# Altium schematic sheet oxi_dev3.SchDoc
size A2
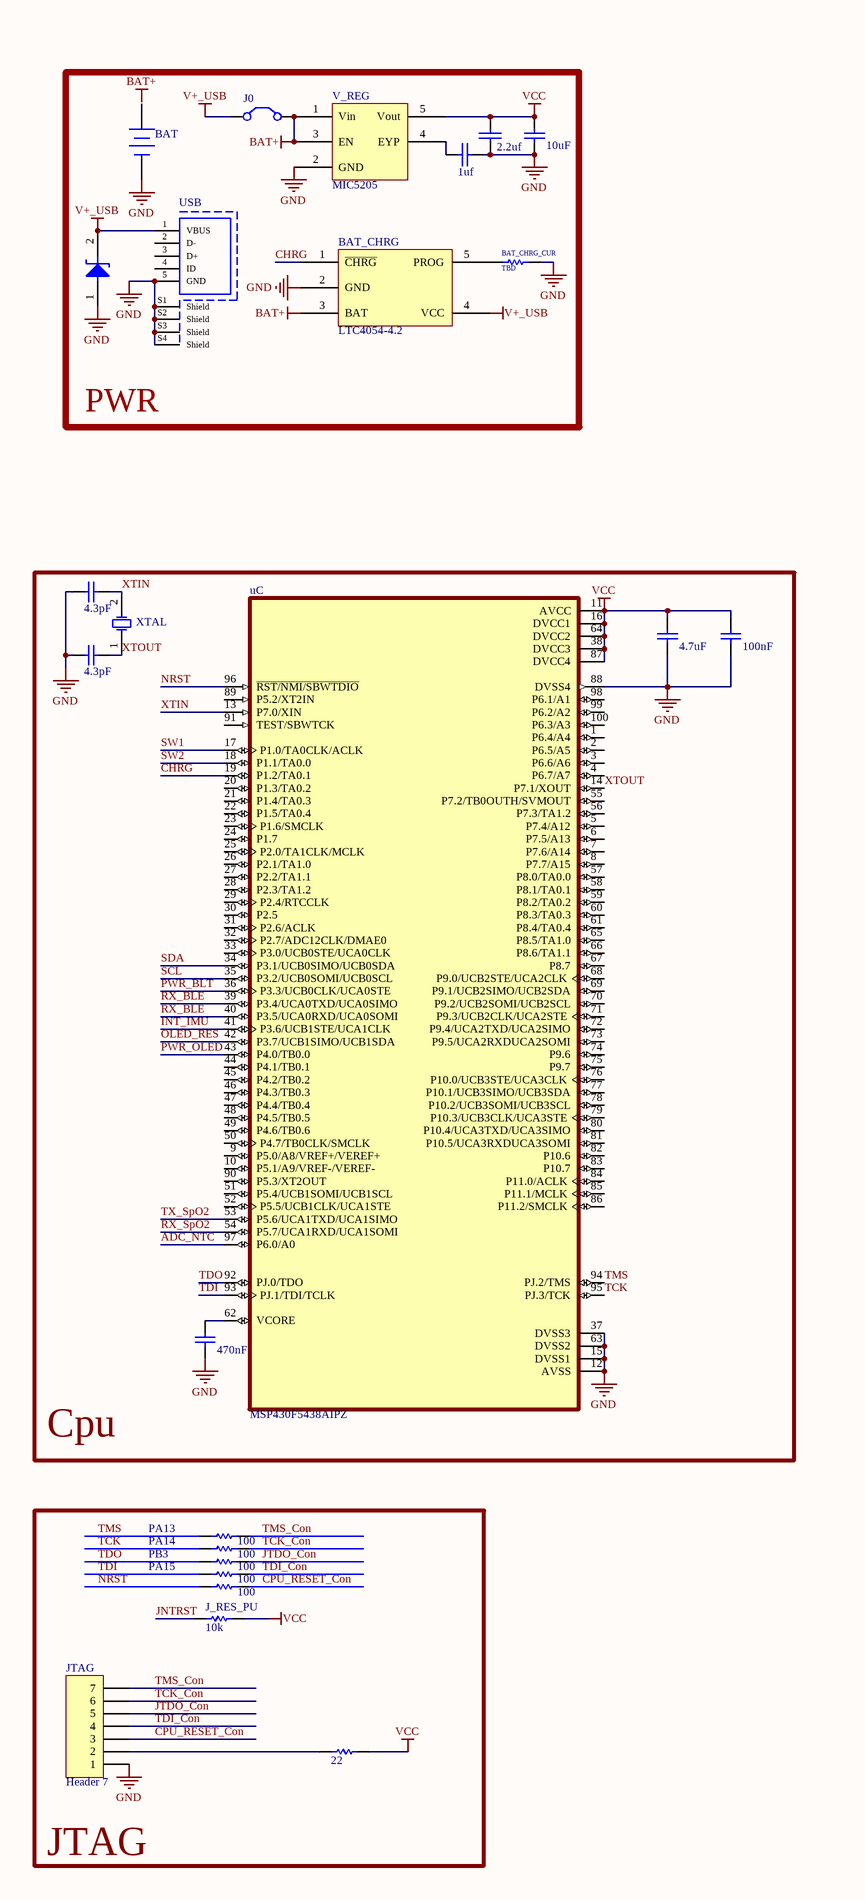
[diagram p0: oxi_dev3.SchDoc, left]
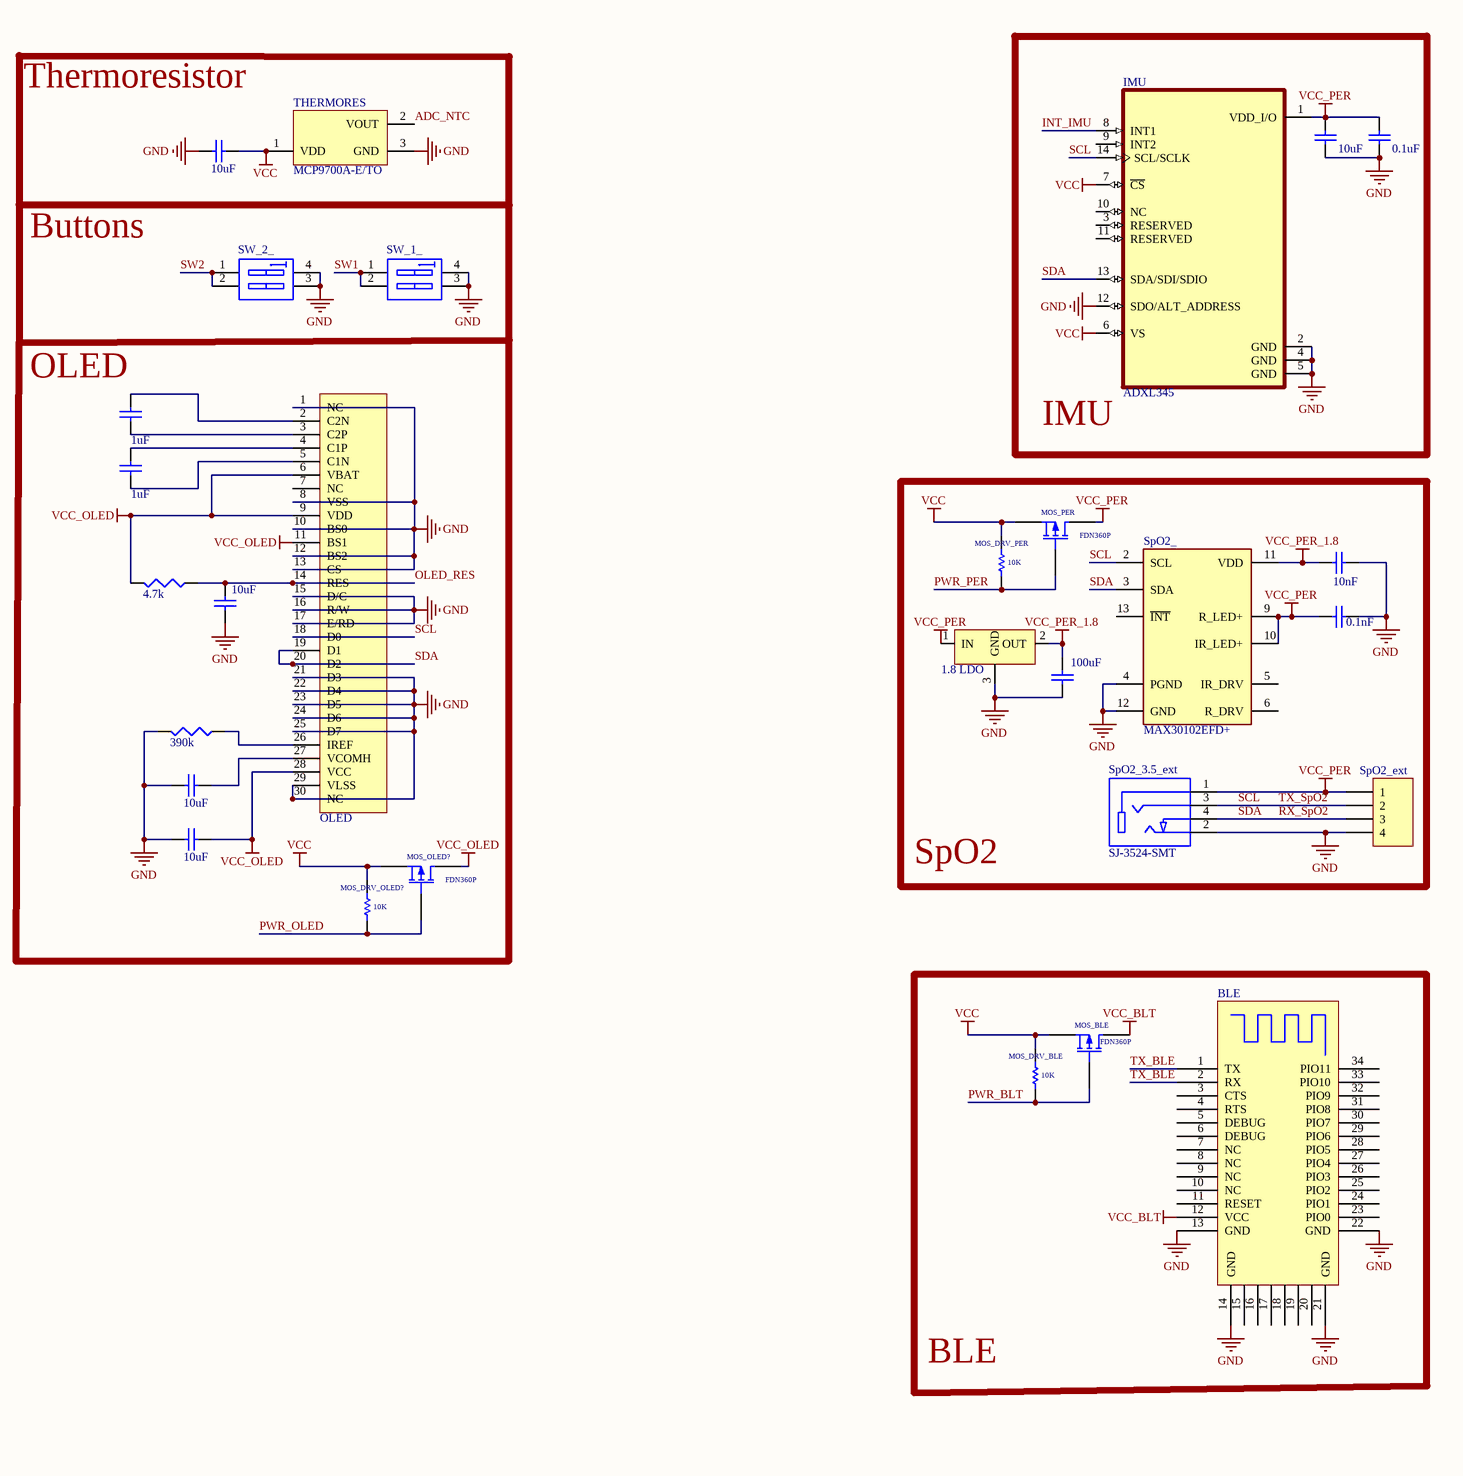
[diagram p1: oxi_dev3.SchDoc, right]

## Parts
1.8_LDO  LM1117S-1.8  [SOT223]  (value not drawn)
BAT  Battery  [BAT-2]  (value not drawn)
BAT_CHRG  LTC4054-4.2  [S5]
BAT_CHRG_CUR  TBD  [SMD-0805C]
BLE  HM-16  [HM-16]  (value not drawn)
BRIGHTNESS_RES?  value 390k  [SMD-0805C]  (hidden comment: Res3)
C23  value 4.7uF  [SMD-0805C]  (hidden comment: Cap Dec msp VCC)
C?  value 100nF  [SMD-0805C]  (hidden comment: Cap Dec msp VCC)
C_PUMP_1  value 1uF  [SMD-0805C]  (hidden comment: Cap Semi)
C_PUMP_2  value 1uF  [SMD-0805C]  (hidden comment: Cap Semi)
C_PUMP_VCMON?  value 10uF  [SMD-0805C]  (hidden comment: Cap Semi)
CAP_1.8_DEC  value 100uF  [SMD-0805C]  (hidden comment: Cap Semi)
CAP_IMU_DEC_1  value 10uF  [SMD-0805C]  (hidden comment: Cap Semi)
CAP_IMU_DEC_2  value 0.1uF  [SMD-0805C]  (hidden comment: Cap Semi)
CAP_LED_BYP?  value 0.1nF  [SMD-0805C]  (hidden comment: Cap Semi)
CAP_LED_DEC?  value 10nF  [SMD-0805C]  (hidden comment: Cap Semi)
CAP_VCORE  value 470nF  [SMD-0805C]  (hidden comment: Cap Semi)
IMU  ADXL345  [ADXL345]
J0  SC_USB_ONLY  [SMD-0805C]  (value not drawn)
J_RES_PU  10k  [SMD-0805C]
JTAG  Header 7  [HDR1X7]
JTDI_VDIV  100  [SMD-0805C]
JTDO_VDIV  100  [SMD-0805C]
JVCC_VDIV  22  [SMD-0805C]
MOS_BLE  FDN360P  [SOT23_N]
MOS_DRV_BLE  10K  [SMD-0805C]
MOS_DRV_OLED?  10K  [SMD-0805C]
MOS_DRV_PER  10K  [SMD-0805C]
MOS_OLED?  FDN360P  [SOT23_N]
MOS_PER  FDN360P  [SOT23_N]
NRST_VDIV  100  [SMD-0805C]
NTC_CAP?  value 10uF  [SMD-0805C]  (hidden comment: Cap Semi)
OLED  OLED  [OLED0.96_NO3D]  (value not drawn)
OLED_C_STABILITY?  value 10uF  [SMD-0805C]  (hidden comment: Cap Semi)
OLED_RES_PU  value 4.7k  [SMD-0805C]  (hidden comment: Res3)
REG_BYP?  1uf  [SMD-0805C]
REG_DEC?  2.2uf  [SMD-0805C]
RES_BYPASS  value 10uF  [SMD-0805C]  (hidden comment: Cap Semi)
SpO2_  MAX30102EFD+  [PSON80P330X560X165-14N]
SpO2_3.5_ext  SJ-3524-SMT  [CUI_SJ-3524-SMT]
SpO2_ext  Header 4  [HDR1X4]  (value not drawn)
SW_1_  SW DIP-2  [PUSH_BTN]  (value not drawn)
SW_2_  SW DIP-2  [PUSH_BTN]  (value not drawn)
TCK_VDIV  100  [SMD-0805C]
THERMORES  MCP9700A-E/TO  [TO-92-TO3]
TMS_VDIV  100  [SMD-0805C]
uC  MSP430F5438AIPZ  [QFP50P1600X1600X160-100N]
USB  Micro USB 2.0 Type B Receptacle  [629105150521]  (value not drawn)
V_REG  MIC5205  [SOT-23-OT5_N]
VOL_REG_CAP_IN?  value 10uF  [SMD-0805C]  (hidden comment: Cap Semi)
XTAL?  XTAL  [AXIAL-0.3]
XTAL_IN?  value 4.3pF  [SMD-0805C]  (hidden comment: Cap Semi)
XTAL_OUT?  value 4.3pF  [SMD-0805C]  (hidden comment: Cap Semi)
ZEN_USB?  5V  [DO-35]  (value not drawn)

## Blocks framed on the sheet
IMU: CAP_IMU_DEC_1 CAP_IMU_DEC_2 IMU
PWR: BAT BAT_CHRG BAT_CHRG_CUR J0 REG_BYP? REG_DEC? USB V_REG VOL_REG_CAP_IN? ZEN_USB?
SpO2: 1.8_LDO CAP_1.8_DEC CAP_LED_BYP? CAP_LED_DEC? MOS_DRV_PER MOS_PER SpO2_ SpO2_3.5_ext SpO2_ext
Cpu: C23 C? CAP_VCORE uC XTAL? XTAL_IN? XTAL_OUT?
BLE: BLE MOS_BLE MOS_DRV_BLE
JTAG: J_RES_PU JTAG JTDI_VDIV JTDO_VDIV JVCC_VDIV NRST_VDIV TCK_VDIV TMS_VDIV

## Nets
BAT+: BAT_CHRG.3(BAT) J0.2(C2) V_REG.1(Vin) V_REG.3(EN)
GND: 1.8_LDO.3(GND) BAT.2(-) BAT_CHRG.2(GND) BAT_CHRG_CUR.2 BLE.13(GND) BLE.14(GND) BLE.21(GND) BLE.22(GND) BRIGHTNESS_RES?.2 C23.1 C?.1 C_PUMP_VCMON?.2 CAP_1.8_DEC.1 CAP_IMU_DEC_1.1 CAP_IMU_DEC_2.1 CAP_LED_BYP?.2 CAP_LED_DEC?.2 CAP_VCORE.1 IMU.2(GND) IMU.4(GND) IMU.5(GND) IMU.12(SDO/ALT_ADDRESS) JTAG.1 NTC_CAP?.1 OLED.1(NC) OLED.8(VSS) OLED.10(BS0) OLED.12(BS2) OLED.13(CS) OLED.15(D/C) OLED.16(R/W) OLED.17(E/RD) OLED.21(D3) OLED.22(D4) OLED.23(D5) OLED.24(D6) OLED.25(D7) OLED.29(VLSS) OLED.30(NC) OLED_C_STABILITY?.2 REG_BYP?.2 REG_DEC?.2 RES_BYPASS.1 SpO2_.4(PGND) SpO2_.12(GND) SpO2_3.5_ext.2 SpO2_ext.4 SW_1_.3(B2) SW_1_.4(B1) SW_2_.3(B2) SW_2_.4(B1) THERMORES.3(GND) uC.12(AVSS) uC.15(DVSS1) uC.37(DVSS3) uC.63(DVSS2) uC.88(DVSS4) USB.5(GND) USB.S1(Shield) USB.S2(Shield) USB.S3(Shield) USB.S4(Shield) V_REG.2(GND) VOL_REG_CAP_IN?.1 XTAL_IN?.1 XTAL_OUT?.1 ZEN_USB?.1
V+_USB: BAT_CHRG.4(VCC) J0.1(C1) USB.1(VBUS) ZEN_USB?.2
VCC: C23.2 C?.2 IMU.6(VS) IMU.7(~{CS}) J_RES_PU.2 JVCC_VDIV.2 MOS_BLE.2(S) MOS_DRV_BLE.1 MOS_DRV_OLED?.1 MOS_DRV_PER.1 MOS_OLED?.2(S) MOS_PER.2(S) NTC_CAP?.2 REG_DEC?.1 THERMORES.1(VDD) uC.11(AVCC) uC.16(DVCC1) uC.38(DVCC3) uC.64(DVCC2) uC.87(DVCC4) V_REG.5(Vout) VOL_REG_CAP_IN?.2
VCC_BLT: BLE.12(VCC) MOS_BLE.3(D)
VCC_OLED: MOS_OLED?.3(D) OLED.6(VBAT) OLED.9(VDD) OLED.11(BS1) OLED.28(VCC) OLED_C_STABILITY?.1 OLED_RES_PU.2
VCC_PER: 1.8_LDO.1(IN) CAP_IMU_DEC_1.2 CAP_IMU_DEC_2.2 CAP_LED_BYP?.1 IMU.1(VDD_I/O) MOS_PER.3(D) SpO2_.9(R_LED+) SpO2_.10(IR_LED+) SpO2_3.5_ext.1 SpO2_ext.1
VCC_PER_1.8: 1.8_LDO.2(OUT) CAP_1.8_DEC.2 CAP_LED_DEC?.1 SpO2_.11(VDD)
ADC_NTC: THERMORES.2(VOUT) uC.97(P6.0/A0)
CHRG: BAT_CHRG.1(~{CHRG}) uC.19(P1.2/TA0.1)
CPU_~{RESE}T_Co~{n}: JTAG.3 NRST_VDIV.1
INT_IMU: IMU.8(INT1) uC.41(P3.6/UCB1STE/UCA1CLK)
JNTRST: J_RES_PU.1
JTDO_Con: JTAG.5 JTDO_VDIV.1
NRST: NRST_VDIV.2 uC.96(~{RST/NMI/SBWTDIO})
OLED_RES: OLED.14(RES) OLED_RES_PU.1 RES_BYPASS.2 uC.42(P3.7/UCB1SIMO/UCB1SDA)
PWR_BLT: MOS_BLE.1(G) MOS_DRV_BLE.2 uC.36(P3.3/UCB0CLK/UCA0STE)
PWR_OLED: MOS_DRV_OLED?.2 MOS_OLED?.1(G) uC.43(P4.0/TB0.0)
PWR_PER: MOS_DRV_PER.2 MOS_PER.1(G)
RX_BLE: uC.39(P3.4/UCA0TXD/UCA0SIMO) uC.40(P3.5/UCA0RXD/UCA0SOMI)
RX_SpO2: IMU.13(SDA/SDI/SDIO) OLED.19(D1) OLED.20(D2) SpO2_.3(SDA) SpO2_3.5_ext.4 SpO2_ext.3 uC.34(P3.1/UCB0SIMO/UCB0SDA) uC.54(P5.7/UCA1RXD/UCA1SOMI)  [also labelled SDA]
SCL: IMU.14(SCL/SCLK) OLED.18(D0) SpO2_.2(SCL) SpO2_3.5_ext.3 SpO2_ext.2 uC.35(P3.2/UCB0SOMI/UCB0SCL) uC.53(P5.6/UCA1TXD/UCA1SIMO)  [also labelled TX_SpO2]
SW1: SW_1_.1(A1) SW_1_.2(A2) uC.17(P1.0/TA0CLK/ACLK)
SW2: SW_2_.1(A1) SW_2_.2(A2) uC.18(P1.1/TA0.0)
TCK: TCK_VDIV.2 uC.95(PJ.3/TCK)
TCK_Con: JTAG.6 TCK_VDIV.1
TDI: JTDI_VDIV.2 uC.93(PJ.1/TDI/TCLK)
TDI_Con: JTAG.4 JTDI_VDIV.1
TDO: JTDO_VDIV.2 uC.92(PJ.0/TDO)
TMS: TMS_VDIV.2 uC.94(PJ.2/TMS)
TMS_Con: JTAG.7 TMS_VDIV.1
TX_BLE: BLE.1(TX) BLE.2(RX)
XTIN: uC.13(P7.0/XIN) XTAL?.2(OSC2) XTAL_IN?.2
XTOUT: uC.14(P7.1/XOUT) XTAL?.1(OSC1) XTAL_OUT?.2
NetBAT_CHRG_5: BAT_CHRG.5(PROG) BAT_CHRG_CUR.1
NetBRIGHTNESS_RES?_1: BRIGHTNESS_RES?.1 OLED.26(IREF)
NetC_PUMP_1_1: C_PUMP_1.1 OLED.3(C2P)
NetC_PUMP_1_2: C_PUMP_1.2 OLED.2(C2N)
NetC_PUMP_2_1: C_PUMP_2.1 OLED.5(C1N)
NetC_PUMP_2_2: C_PUMP_2.2 OLED.4(C1P)
NetC_PUMP_VCMON?_1: C_PUMP_VCMON?.1 OLED.27(VCOMH)
NetCAP_VCORE_2: CAP_VCORE.2 uC.62(VCORE)
NetJTAG_2: JTAG.2 JVCC_VDIV.1
NetREG_BYP?_1: REG_BYP?.1 V_REG.4(EYP)

Not connected (* = marked no-connect by the designer): BAT 1(+); BLE 3(CTS) 4(RTS) 5(DEBUG) 6(DEBUG) 7(NC) 8(NC) 9(NC) 10(NC) 11(RESET) 15 16 17 18 19 20 23(PIO0) 24(PIO1) 25(PIO2) 26(PIO3) 27(PIO4) 28(PIO5) 29(PIO6) 30(PIO7) 31(PIO8) 32(PIO9) 33(PIO10) 34(PIO11); IMU 3(RESERVED) 9(INT2) 10(NC) 11(RESERVED); OLED 7(NC); SpO2_ 5(IR_DRV) 6(R_DRV) 13(~{INT}); uC 1(P6.4/A4) 2(P6.5/A5) 3(P6.6/A6) 4(P6.7/A7) 5(P7.4/A12) 6(P7.5/A13) 7(P7.6/A14) 8(P7.7/A15) 9(P5.0/A8/VREF+/VEREF+) 10(P5.1/A9/VREF-/VEREF-) 20(P1.3/TA0.2) 21(P1.4/TA0.3) 22(P1.5/TA0.4) 23(P1.6/SMCLK) 24(P1.7) 25(P2.0/TA1CLK/MCLK) 26(P2.1/TA1.0) 27(P2.2/TA1.1) 28(P2.3/TA1.2) 29(P2.4/RTCCLK) 30(P2.5) 31(P2.6/ACLK) 32(P2.7/ADC12CLK/DMAE0) 33(P3.0/UCB0STE/UCA0CLK) 44(P4.1/TB0.1) 45(P4.2/TB0.2) 46(P4.3/TB0.3) 47(P4.4/TB0.4) 48(P4.5/TB0.5) 49(P4.6/TB0.6) 50(P4.7/TB0CLK/SMCLK) 51(P5.4/UCB1SOMI/UCB1SCL) 52(P5.5/UCB1CLK/UCA1STE) 55(P7.2/TB0OUTH/SVMOUT) 56(P7.3/TA1.2) 57(P8.0/TA0.0) 58(P8.1/TA0.1) 59(P8.2/TA0.2) 60(P8.3/TA0.3) 61(P8.4/TA0.4) 65(P8.5/TA1.0) 66(P8.6/TA1.1) 67(P8.7) 68(P9.0/UCB2STE/UCA2CLK) 69(P9.1/UCB2SIMO/UCB2SDA) 70(P9.2/UCB2SOMI/UCB2SCL) 71(P9.3/UCB2CLK/UCA2STE) 72(P9.4/UCA2TXD/UCA2SIMO) 73(P9.5/UCA2RXDUCA2SOMI) 74(P9.6) 75(P9.7) 76(P10.0/UCB3STE/UCA3CLK) 77(P10.1/UCB3SIMO/UCB3SDA) 78(P10.2/UCB3SOMI/UCB3SCL) 79(P10.3/UCB3CLK/UCA3STE) 80(P10.4/UCA3TXD/UCA3SIMO) 81(P10.5/UCA3RXDUCA3SOMI) 82(P10.6) 83(P10.7) 84(P11.0/ACLK) 85(P11.1/MCLK) 86(P11.2/SMCLK) 89(P5.2/XT2IN) 90(P5.3/XT2OUT) 91(TEST/SBWTCK) 98(P6.1/A1) 99(P6.2/A2) 100(P6.3/A3); USB 2(D-) 3(D+) 4(ID)

## Notes on the sheet
- (near THERMORES) Thermoresistor
- Buttons
- (near C_PUMP_1) OLED
- PB3
- PA15
- PA14
- PA13
- Labels drawn without touching a wire or pin: BAT+

## Library data of the parts
BAT = Battery: Multicell Battery; Published: 24-Mar-1999; LatestRevisionDate: 17-Jul-2002; LatestRevisionNote: Re-released for DXP Platform.; PackageReference: BAT-2; Publisher: Altium Limited; PackageDescription: Battery; 2 Leads
BAT_CHRG_CUR = res1: Resistor; Published: 8-Jun-2000; Revision: July-2002: Re-released for DXP Platform.; Publisher: Altium Limited; Value: TBD
BRIGHTNESS_RES? OLED_RES_PU = Res3: Resistor; Published: 8-Jun-2000; LatestRevisionDate: 29-May-2009; LatestRevisionNote: IPC-7351 Footprint Added.; PackageReference: J1-0603; Publisher: Altium Limited; PackageDescription: Chip Resistor
C23 C? C_PUMP_1 C_PUMP_2 C_PUMP_VCMON? CAP_1.8_DEC CAP_IMU_DEC_1 CAP_IMU_DEC_2 CAP_LED_BYP? CAP_LED_DEC? CAP_VCORE NTC_CAP? OLED_C_STABILITY? RES_BYPASS VOL_REG_CAP_IN? XTAL_IN? XTAL_OUT? = Cap Semi: Capacitor (Semiconductor SIM Model); Published: 8-Jun-2000; LatestRevisionDate: 29-May-2009; LatestRevisionNote: IPC-7351 Footprint Added.; PackageReference: C1206; Publisher: Altium Limited; PackageDescription: Chip Capacitor
J0 = Jumper: Jumper Wire; Published: 24-Mar-1999; LatestRevisionDate: 17-Jul-2002; LatestRevisionNote: Re-released for DXP Platform.; PackageReference: RAD-0.2; Publisher: Altium Limited; PackageDescription: Radial Cap, Thru-Hole; 2 Leads; 0.2 in Pin Spacing
J_RES_PU JTDI_VDIV JTDO_VDIV JVCC_VDIV NRST_VDIV TCK_VDIV TMS_VDIV = Res1: Resistor; Value: 1K; Published: 8-Jun-2000; Revision: July-2002: Re-released for DXP Platform.; Publisher: Altium Limited
JTAG = Header 7: Header, 7-Pin; LatestRevisionDate: 17-Jul-2002; LatestRevisionNote: Re-released for DXP Platform.; Publisher: Altium Limited
MOS_BLE MOS_OLED? MOS_PER = MOSFET-P: P-Channel MOSFET; Published: 8-Jun-2000; LatestRevisionDate: 17-Jul-2002; LatestRevisionNote: Re-released for DXP Platform.; PackageVersion: 1995/1996; PackageReference: E3; Publisher: Altium Limited; PackageDescription: TO, Flat Index; 3 In-Line, Axial Leads; Body Dia. 4.6mm; Lead Dia. 0.5 mm (max)
MOS_DRV_BLE MOS_DRV_OLED? MOS_DRV_PER = res1: Resistor; Value: 1K; Published: 8-Jun-2000; Revision: July-2002: Re-released for DXP Platform.; Publisher: Altium Limited
OLED = OLED0.96
REG_BYP? REG_DEC? = CAP: Capacitor
SpO2_ = MAX30102EFD+: Oximeter/Heart Rate Sensor IÂ²C Output; MF: Maxim Integrated; Price: None; Value: *; Package: OLGA-14 Maxim; Availability: Unavailable; SnapEDA_Link: https://www.snapeda.com/parts/MAX30102EFD%2B/Maxim%20Integrated/view-part/397548/?ref=snap; MP: MAX30102EFD+
SpO2_3.5_ext = SJ-3524-SMT: 3.5 mm, Stereo, Right Angle, Surface Mount _SMT_, Audio Jack Connector; MP: SJ-3524-SMT-TR; MF: CUI Devices; Price: None; Package: None; Value: *; Availability: Unavailable; CUI_purchase_URL: https://www.cuidevices.com/product/interconnect/connectors/audio-connectors/jacks/sj-352x-smt-series?utm_source=snapeda.com&utm_medium=referral&utm_campaign=snapedaBOM; SnapEDA_Link: https://www.snapeda.com/parts/SJ-3524-SMT-TR/CUI%20Devices/view-part/328268/?ref=snap
SpO2_ext = Header 4: Header, 4-Pin; LatestRevisionDate: 17-Jul-2002; LatestRevisionNote: Re-released for DXP Platform.; Publisher: Altium Limited
SW_1_ SW_2_ = SW DIP-2: DIP Switch, 2 Position, SPST; Published: 24-Mar-1999; LatestRevisionDate: 17-Jul-2002; LatestRevisionNote: Re-released for DXP Platform.; PackageReference: DIP-4; Publisher: Altium Limited
THERMORES = MCP9700A-E/TO: Low-Power Linear Active Thermistor IC, 3-Pin TO-92, Extended Temperature; Published: 29-Jan-2009; LatestRevisionDate: 02-Dec-2009; LatestRevisionNote: Updated datasheet to version revE, Apr-2009.; DatasheetVersion: revE, Apr-2009; PackageVersion: revBB, Aug-2009; PackageReference: TO-92-TO3; Publisher: Altium Limited; PackageDescription: 3-Lead Plastic Transistor Outline (TO) [TO-92]; Supplier 1: Digi-Key; Supplier Part Number 1: MCP9700A-E/TO-ND; Supplier 2: Farnell; Supplier Part Number 2: 1332164; ComponentLink1Description: Datasheet; ComponentLink1URL: http://ww1.microchip.com/downloads/en/DeviceDoc/21942e.pdf; ComponentLink2Description: Packaging Specification; ComponentLink2URL: http://www.microchip.com/stellent/groups/techpub_sg/documents/packagingspec/en012702.pdf; ComponentLink3Description: Microchip.com Home; ComponentLink3URL: http://www.microchip.com/
uC = MSP430F5438AIPZ: 18 MHz MCU with 256KB Flash, 16KB SRAM, 12-bit ADC, DMA, UART/SPI/I2C, Timer, HW Multiplier 100-LQFP -40 to 85; MF: Texas Instruments; SnapEDA_Link: https://www.snapeda.com/parts/MSP430F5438AIPZ/Texas%20Instruments/view-part/374696/?ref=snap; Availability: Unavailable; MP: MSP430F5438AIPZ; Purchase-URL: https://pricing.snapeda.com/search/part/MSP430F5438AIPZ/?ref=eda; Check_prices: https://www.snapeda.com/parts/MSP430F5438AIPZ/Texas%20Instruments/view-part/374696/?ref=eda; Price: None; Value: *; Package: LQFP-100 Texas Instruments
USB = 629105150521: Micro USB 2.0 Type B, Receptacle, Horizontal, SMT, with Pegs; Rated Current: 3A; Pin Number: 5; Interface Type: Type B; Working Voltage: 30VAC; ComponentLink1Description: Manufacturer; ComponentLink1URL: http://www.we-online.de; ComponentLink2Description: Datasheet; ComponentLink2URL: https://katalog.we-online.com/em/datasheet/629105150521.pdf; Published Date: September 2019; Publisher: Wurth Elektronik; Part Number: 629105150521; Gender: Receptacle; Type: Horizontal; Packaging: Tape and Reel; Operating Temperature: -40 to +85degC; Mounting Technology: SMT; Application: Micro USB 2.0
V_REG = MIC5205: 150mA Low-Noise LDO Regulator
XTAL? = XTAL: Crystal Oscillator; Published: 8-Jun-2000; LatestRevisionDate: 17-Jul-2002; LatestRevisionNote: Re-released for DXP Platform.; PackageReference: R38; Publisher: Altium Limited; PackageDescription: Crystal, Thru-Hole; 2 Leads; Body 3.1 x 8.2 mm (Dia.xH)
ZEN_USB? = ZENER